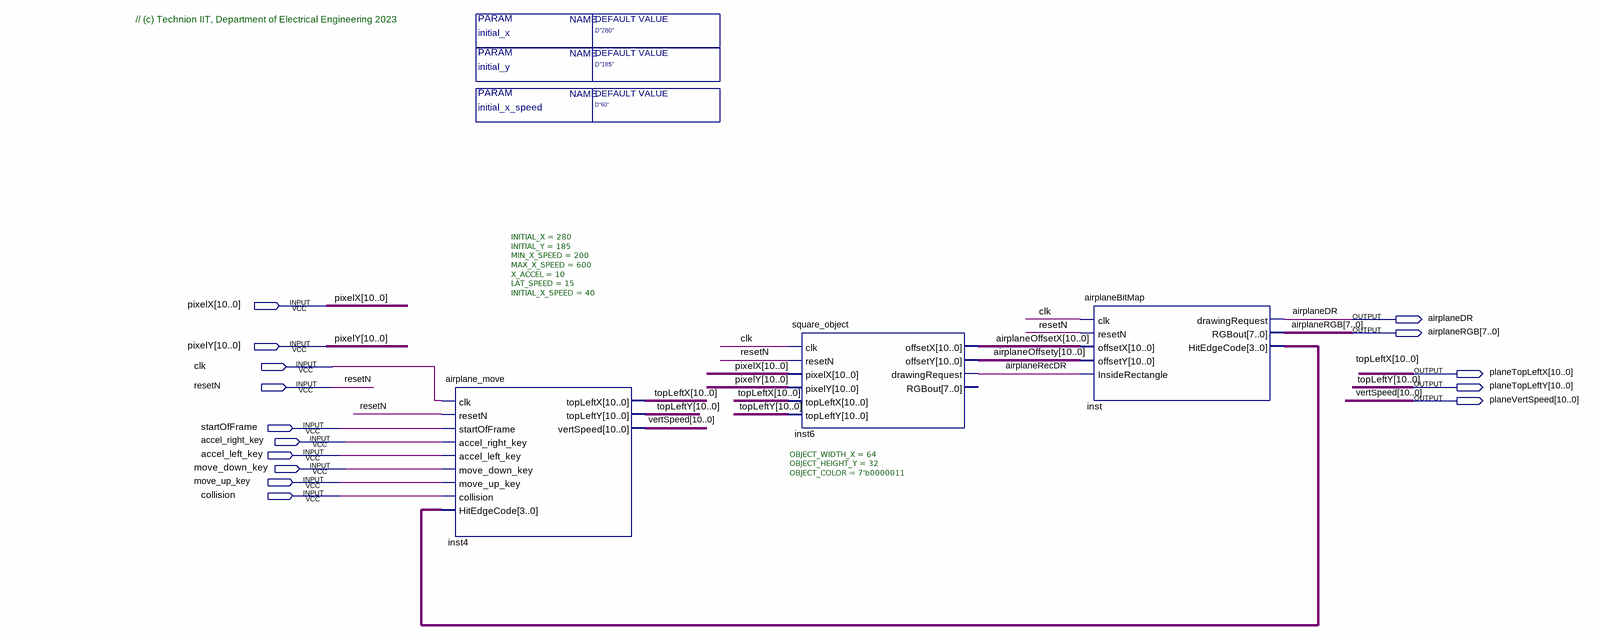
[diagram p0: schematic sheet]
// Quartus schematic Airplne_Block_T.bdf as structural Verilog: 3 symbols, 15 pins
module Airplne_Block_T #(parameter initial_x = "D\"280\"", parameter initial_y = "D\"185\"", parameter initial_x_speed = "D\"60\"") (
  input  [10:0] pixelX,
  input  [10:0] pixelY,
  input  clk,
  input  resetN,
  input  startOfFrame,
  input  accel_right_key,
  input  accel_left_key,
  input  move_down_key,
  input  move_up_key,
  input  collision,
  output airplaneDR,
  output [7:0] airplaneRGB,
  output [10:0] planeTopLeftX,
  output [10:0] planeTopLeftY,
  output [10:0] planeVertSpeed
);

  wire airplaneRecDR;
  wire [3:0] inst_hitedgecode;
  wire [10:0] airplaneOffsetX, airplaneOffsety;

  airplane_move #(.INITIAL_X(280), .INITIAL_Y(185), .MIN_X_SPEED(200), .MAX_X_SPEED(600), .X_ACCEL(10), .LAT_SPEED(15), .INITIAL_X_SPEED(40)) inst4 (
    .clk(clk), .resetN(resetN), .startOfFrame(startOfFrame), .accel_right_key(accel_right_key),
    .accel_left_key(accel_left_key), .move_down_key(move_down_key), .move_up_key(move_up_key),
    .collision(collision), .HitEdgeCode(inst_hitedgecode), .topLeftX(planeTopLeftX),
    .topLeftY(planeTopLeftY), .vertSpeed(planeVertSpeed));
  square_object #(.OBJECT_WIDTH_X(64), .OBJECT_HEIGHT_Y(32), .OBJECT_COLOR(7'b0000011)) inst6 (
    .clk(clk), .resetN(resetN), .pixelX(pixelX), .pixelY(pixelY), .topLeftX(planeTopLeftX),
    .topLeftY(planeTopLeftY), .offsetX(airplaneOffsetX), .offsetY(airplaneOffsety),
    .drawingRequest(airplaneRecDR));  // open: RGBout
  airplaneBitMap inst (
    .clk(clk), .resetN(resetN), .offsetX(airplaneOffsetX), .offsetY(airplaneOffsety),
    .InsideRectangle(airplaneRecDR), .drawingRequest(airplaneDR), .RGBout(airplaneRGB),
    .HitEdgeCode(inst_hitedgecode));

  // Other names for the same wires on the sheet: topLeftX[10:0] = planeTopLeftX; topLeftY[10:0] = planeTopLeftY;
  //   vertSpeed[10:0] = planeVertSpeed

  // Notes on the sheet:
  //   // (c) Technion IIT, Department of Electrical Engineering 2023
endmodule
